# EAGLE design Via Card v2 (EAGLE 4.16)
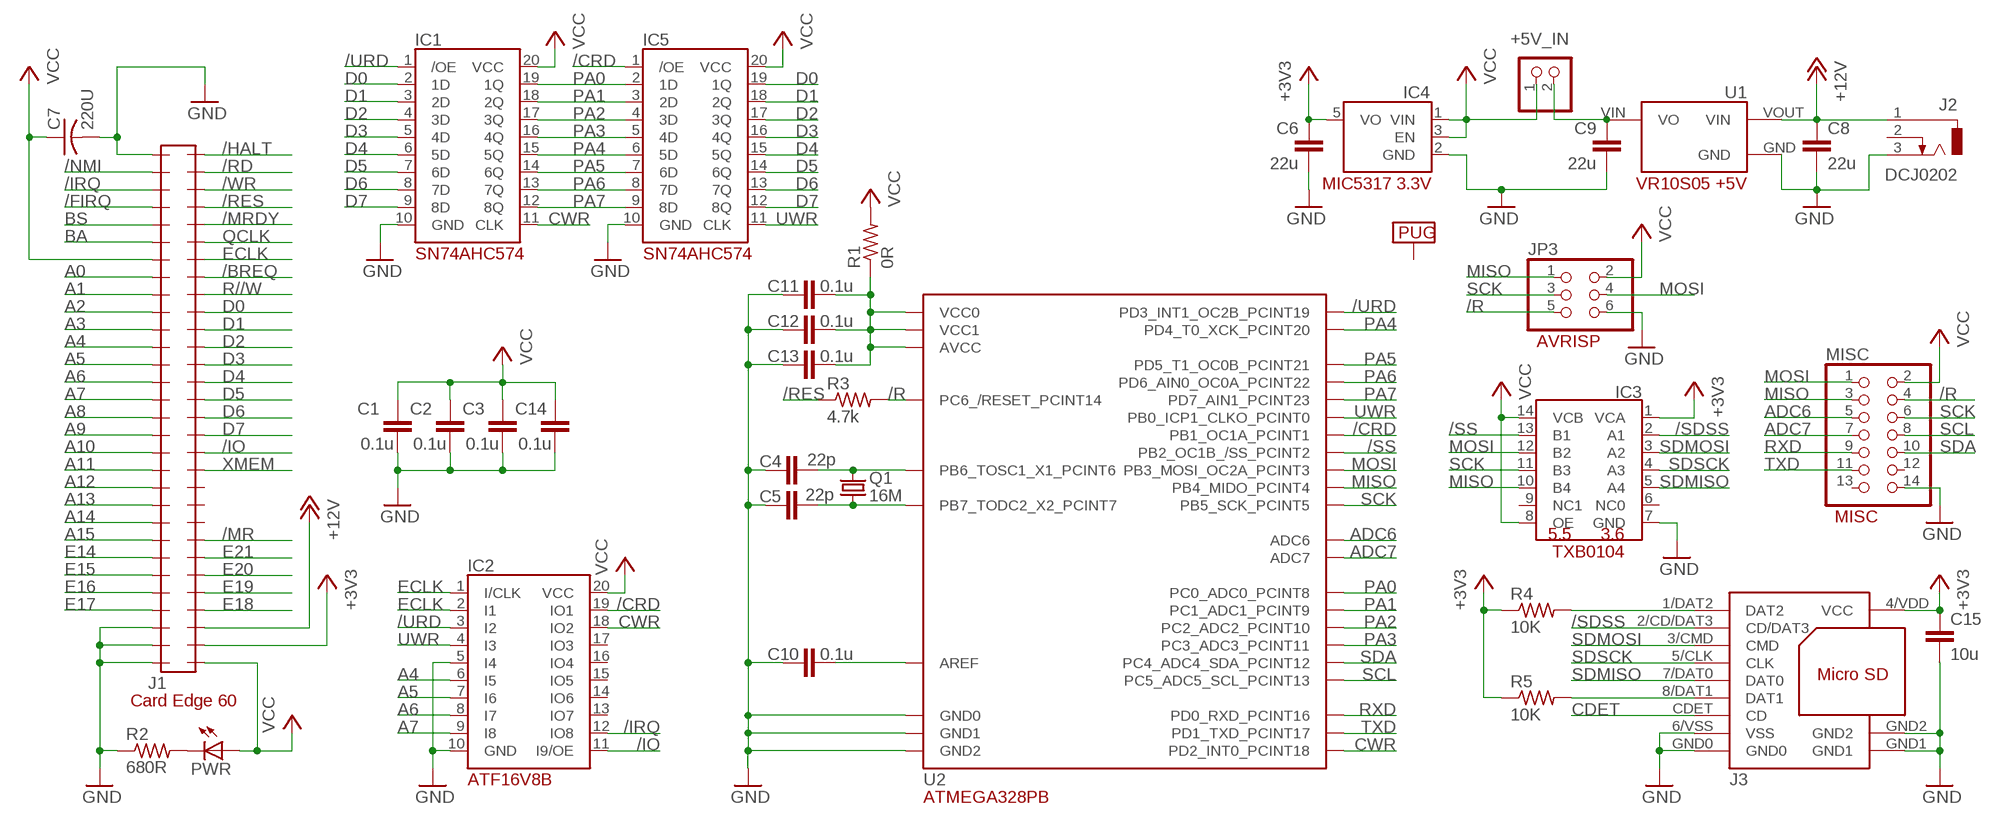
[diagram p0: schematic, sheet 1]

## Parts
+5V_IN  PINHD-1X2  [1X02]
C1  0.1u  C-EUC0603  [C0603]
C2  0.1u  C-EUC0603  [C0603]
C3  0.1u  C-EUC0603  [C0603]
C4  22p  C-EUC0603  [C0603]
C5  22p  C-EUC0603  [C0603]
C6  22u  C-EUC0805  [C0805]
C7  220U  C-US025-050X050  [C025-050X050]
C8  22u  C-EUC1206  [C1206]
C9  22u  C-EUC1206  [C1206]
C10  0.1u  C-EUC0603  [C0603]
C11  0.1u  C-EUC0603  [C0603]
C12  0.1u  C-EUC0603  [C0603]
C13  0.1u  C-EUC0603  [C0603]
C14  0.1u  C-EUC0603  [C0603]
C15  10u  C-EUC0805  [C0805]
IC1  SN74AHC574PWRSO  [SOIC20]
IC2  PLD_ATF16V8B  [DIL20]
IC3  TXB0104D  [SOIC14]
IC4  MIC5317_3.3V  [SOT23-5]
IC5  SN74AHC574PWRSO  [SOIC20]
J1  CARDEDGE_2.54_60POS  CARDEDGE_2.54_60POSEDGE  [CARDEDGE_2.54_60POS]
J2  DCJ0202  [DCJ0202]
J3  MICROSD_AMPHENOL_GTFP084328  [MICROSD_AMPHENOL_GTFP08432B1HR]
JP3  PINHD-2X3  [2X03]
MISC  PINHD-2X7  [2X07]
PWR  LED3MM  [LED3MM]
Q1  16M  CRYSTALHC49S  [HC49/S]
R1  0R  R-US_R0603  [R0603]
R2  680R  R-US_R0603  [R0603]
R3  4.7k  R-US_R0603  [R0603]
R4  10K  R-US_R0603  [R0603]
R5  10K  R-US_R0603  [R0603]
U1  VREG_5V_VR10S05  [VREG_5V_CP_POWER_VR10S05]
U2  ATMEGA238PTQFP_  [TQFP32-08]
U$1  PUG  [LARGE_PUG]

## Nets
+3V3 [supply]: C6.1 C15.1 IC3.1(VCA) IC4.5(VO) J1.32 J3.4/VDD(VCC) R4.1 R5.1
+12V [supply]: C8.1 J1.33 J2.1 U1.VOUT(VIN)
/BREQ: J1.53
/CRD: IC2.19(IO1) IC5.1(/OE) U2.13(PB1_OC1A_PCINT1)
/FIRQ: J1.4
/HALT: J1.60
/IO: IC2.11(I9/OE) J1.43
/IRQ: IC2.12(IO8) J1.3
/MR: J1.38
/MRDY: J1.56
/NMI: J1.2
/R: JP3.5 MISC.4 R3.2 U2.29(PC6_/RESET_PCINT14)
/RD: J1.59
/RES: J1.57 R3.1
/SDSS: IC3.2(A1) J3.2/CD/DAT3(CD/DAT3)
/SS: IC3.13(B1) U2.14(PB2_OC1B_/SS_PCINT2)
/URD: IC1.1(/OE) IC2.3(I2) U2.1(PD3_INT1_OC2B_PCINT19)
/WR: J1.58
A0: J1.8
A1: J1.9
A2: J1.10
A3: J1.11
A4: IC2.6(I5) J1.12
A5: IC2.7(I6) J1.13
A6: IC2.8(I7) J1.14
A7: IC2.9(I8) J1.15
A8: J1.16
A9: J1.17
A10: J1.18
A11: J1.19
A12: J1.20
A13: J1.21
A14: J1.22
A15: J1.23
ADC6: MISC.5 U2.19(ADC6)
ADC7: MISC.7 U2.22(ADC7)
BA: J1.6
BS: J1.5
CDET: J3.CDET(CD)
CWR: IC1.11(CLK) IC2.18(IO2) U2.32(PD2_INT0_PCINT18)
D0: IC1.2(1D) IC5.19(1Q) J1.51
D1: IC1.3(2D) IC5.18(2Q) J1.50
D2: IC1.4(3D) IC5.17(3Q) J1.49
D3: IC1.5(4D) IC5.16(4Q) J1.48
D4: IC1.6(5D) IC5.15(5Q) J1.47
D5: IC1.7(6D) IC5.14(6Q) J1.46
D6: IC1.8(7D) IC5.13(7Q) J1.45
D7: IC1.9(8D) IC5.12(8Q) J1.44
E14: J1.24
E15: J1.25
E16: J1.26
E17: J1.27
E18: J1.34
E19: J1.35
E20: J1.36
E21: J1.37
ECLK: IC2.1(I/CLK) IC2.2(I1) J1.54
GND [lowpwr]: C1.2 C2.2 C3.2 C4.1 C5.1 C6.2 C7.2 C8.2 C9.2 C10.1 C11.1 C12.1 C13.1 C14.2 C15.2 IC1.10(GND) IC2.5(I4) IC2.10(GND) IC3.7(GND) IC4.2(GND) IC5.10(GND) J1.1 J1.28 J1.29 J1.30 J2.3 J3.6/VSS(VSS) J3.GND0 J3.GND1 J3.GND2 JP3.6 MISC.14 R2.1 U1.GND U2.3(GND0) U2.5(GND1) U2.21(GND2)
MISO: IC3.10(B4) JP3.1 MISC.3 U2.16(PB4_MIDO_PCINT4)
MOSI: IC3.12(B2) JP3.4 MISC.1 U2.15(PB3_MOSI_OC2A_PCINT3)
N$1: J3.1/DAT2(DAT2) R4.2
N$2: PWR.K(C) R2.2
N$3 [lowpwr]: C11.2 C12.2 C13.2 R1.1 U2.4(VCC0) U2.6(VCC1) U2.18(AVCC)
N$6 [supply]: +5V_IN.2 C9.1 U1.VIN(VO)
N$7: J3.8/DAT1(DAT1) R5.2
N$15: C4.2 Q1.2 U2.7(PB6_TOSC1_X1_PCINT6)
N$16: C5.2 Q1.1 U2.8(PB7_TODC2_X2_PCINT7)
N$18 [lowpwr]: C10.2 U2.20(AREF)
PA0: IC1.19(1Q) IC5.2(1D) U2.23(PC0_ADC0_PCINT8)
PA1: IC1.18(2Q) IC5.3(2D) U2.24(PC1_ADC1_PCINT9)
PA2: IC1.17(3Q) IC5.4(3D) U2.25(PC2_ADC2_PCINT10)
PA3: IC1.16(4Q) IC5.5(4D) U2.26(PC3_ADC3_PCINT11)
PA4: IC1.15(5Q) IC5.6(5D) U2.2(PD4_T0_XCK_PCINT20)
PA5: IC1.14(6Q) IC5.7(6D) U2.9(PD5_T1_OC0B_PCINT21)
PA6: IC1.13(7Q) IC5.8(7D) U2.10(PD6_AIN0_OC0A_PCINT22)
PA7: IC1.12(8Q) IC5.9(8D) U2.11(PD7_AIN1_PCINT23)
QCLK: J1.55
R//W: J1.52
RXD: MISC.9 U2.30(PD0_RXD_PCINT16)
SCK: IC3.11(B3) JP3.3 MISC.6 U2.17(PB5_SCK_PCINT5)
SCL: MISC.8 U2.28(PC5_ADC5_SCL_PCINT13)
SDA: MISC.10 U2.27(PC4_ADC4_SDA_PCINT12)
SDMISO [lowpwr]: IC3.5(A4) J3.7/DAT0(DAT0)
SDMOSI [lowpwr]: IC3.3(A2) J3.3/CMD(CMD)
SDSCK [lowpwr]: IC3.4(A3) J3.5/CLK(CLK)
TXD: MISC.11 U2.31(PD1_TXD_PCINT17)
UWR: IC2.4(I3) IC5.11(CLK) U2.12(PB0_ICP1_CLKO_PCINT0)
VCC [supply]: +5V_IN.1 C1.1 C2.1 C3.1 C7.1 C14.1 IC1.20(VCC) IC2.20(VCC) IC3.8(OE) IC3.14(VCB) IC4.1(VIN) IC4.3(EN) IC5.20(VCC) J1.7 J1.31 JP3.2 MISC.2 PWR.A R1.2
XMEM: J1.42
Unconnected: IC2.13(IO7) IC2.14(IO6) IC2.15(IO5) IC2.16(IO4) IC2.17(IO3) IC3.6(NC0) IC3.9(NC1) J1.39 J1.40 J1.41 J2.2 MISC.12 MISC.13 U$1.P$1

## Notes on the sheet
- AVRISP
- MISC
- ATMEGA328PB

## Library data of the parts
+5V_IN = pinhead:PINHD-1X2: PIN HEADER
C1-C6 C8-C15 = rcl:C-EU: CAPACITOR, European symbol
C7 = rcl:C-US: CAPACITOR, American symbol
IC1 IC5 = 07-Retrocomputing:SN74AHC574PWR
IC2 = 07-Retrocomputing:PLD_ATF16V8B
IC3 = 07-Retrocomputing:TXB0104
IC4 = 07-Retrocomputing:MIC5317_3.3V
J1 = 07-Retrocomputing:CARDEDGE_2.54_60POS
J2 = con-jack:DCJ0202: DC POWER JACK Source: DCJ0202.pdf
J3 = 07-Retrocomputing:MICROSD_AMPHENOL_GTFP084328
JP3 = pinhead:PINHD-2X3: PIN HEADER
MISC = pinhead:PINHD-2X7: PIN HEADER
PWR = led:LED: LED OSRAM: - CHIPLED LG R971, LG N971, LY N971, LG Q971, LY Q971, LO R971, LY R971 LH N974, LH R974 LS Q976, LO Q976, LY Q976 LO Q996 - Hyper CHIPLED LW Q18S LB Q993, LB Q99A, LB R99A - SideLED LS A670, LO A670, LY A670, LG A670, LP A670 LB A673, LV A673, LT A673, LW A673 LH A674 LY A675 LS A676, LA A676, LO A676, LY A676, LW A676 LS A679, LY A679, LG A679 - Hyper Micro SIDELED® LS Y876, LA Y876, LO Y876, LY Y876 LT Y87S - SmartLED LW L88C, LW L88S LB L89C, LB L89S, LG L890 LS L89K, LO L89K, LY L89K LS L896, LA L896, LO L896, LY L896 - TOPLED LS T670, LO T670, LY T670, LG T670, LP T670 LSG T670, LSP T670, LSY T670, LOP T670, LYG T670 LG T671, LOG T671, LSG T671 LB T673, LV T673, LT T673, LW T673 LH T674 LS T676, LA T676, LO T676, LY T676, LB T676, LH T676, LSB T676, LW T676 LB T67C, LV T67C, LT T67C, LS T67K, LO T67K, LY T67K, LW E67C LS E67B, LA E67B, LO E67B, LY E67B, LB E67C, LV E67C, LT E67C LW T67C LS T679, LY T679, LG T679 LS T770, LO T770, LY T770, LG T770, LP T770 LB T773, LV T773, LT T773, LW T773 LH T774 LS E675, LA E675, LY E675, LS T675 LS T776, LA T776, LO T776, LY T776, LB T776 LHGB T686 LT T68C, LB T68C - Hyper Mini TOPLED® LB M676 - Mini TOPLED Santana® LG M470 LS M47K, LO M47K, LY M47K Source: http://www.osram.convergy.de - LUMILED® LXK2-PW12-R00, LXK2-PW12-S00, LXK2-PW14-U00, LXK2-PW14-V00 LXK2-PM12-R00, LXK2-PM12-S00, LXK2-PM14-U00 LXK2-PE12-Q00, LXK2-PE12-R00, LXK2-PE12-S00, LXK2-PE14-T00, LXK2-PE14-U00 LXK2-PB12-K00, LXK2-PB12-L00, LXK2-PB12-M00, LXK2-PB14-N00, LXK2-PB14-P00, LXK2-PB14-Q00 LXK2-PR12-L00, LXK2-PR12-M00, LXK2-PR14-Q00, LXK2-PR14-R00 LXK2-PD12-Q00, LXK2-PD12-R00, LXK2-PD12-S00 LXK2-PH12-R00, LXK2-PH12-S00 LXK2-PL12-P00, LXK2-PL12-Q00, LXK2-PL12-R00 Source: www.luxeon.com
Q1 = crystal:CRYSTAL: CRYSTAL
R1-R5 = rcl:R-US_: RESISTOR, American symbol
U1 = 07-Retrocomputing:VREG_5V_VR10S05
U2 = 02_atmel:ATMEGA238P
U$1 = 07-Retrocomputing:PUG

## Net classes
0 default: width 0.203 mm, drill 0.203 mm, clearance 0.254 mm
1 supply: width 0.61 mm, drill 0.203 mm, clearance 0.305 mm
2 lowpwr: width 0.254 mm, drill 0.203 mm, clearance 0.254 mm

## Board
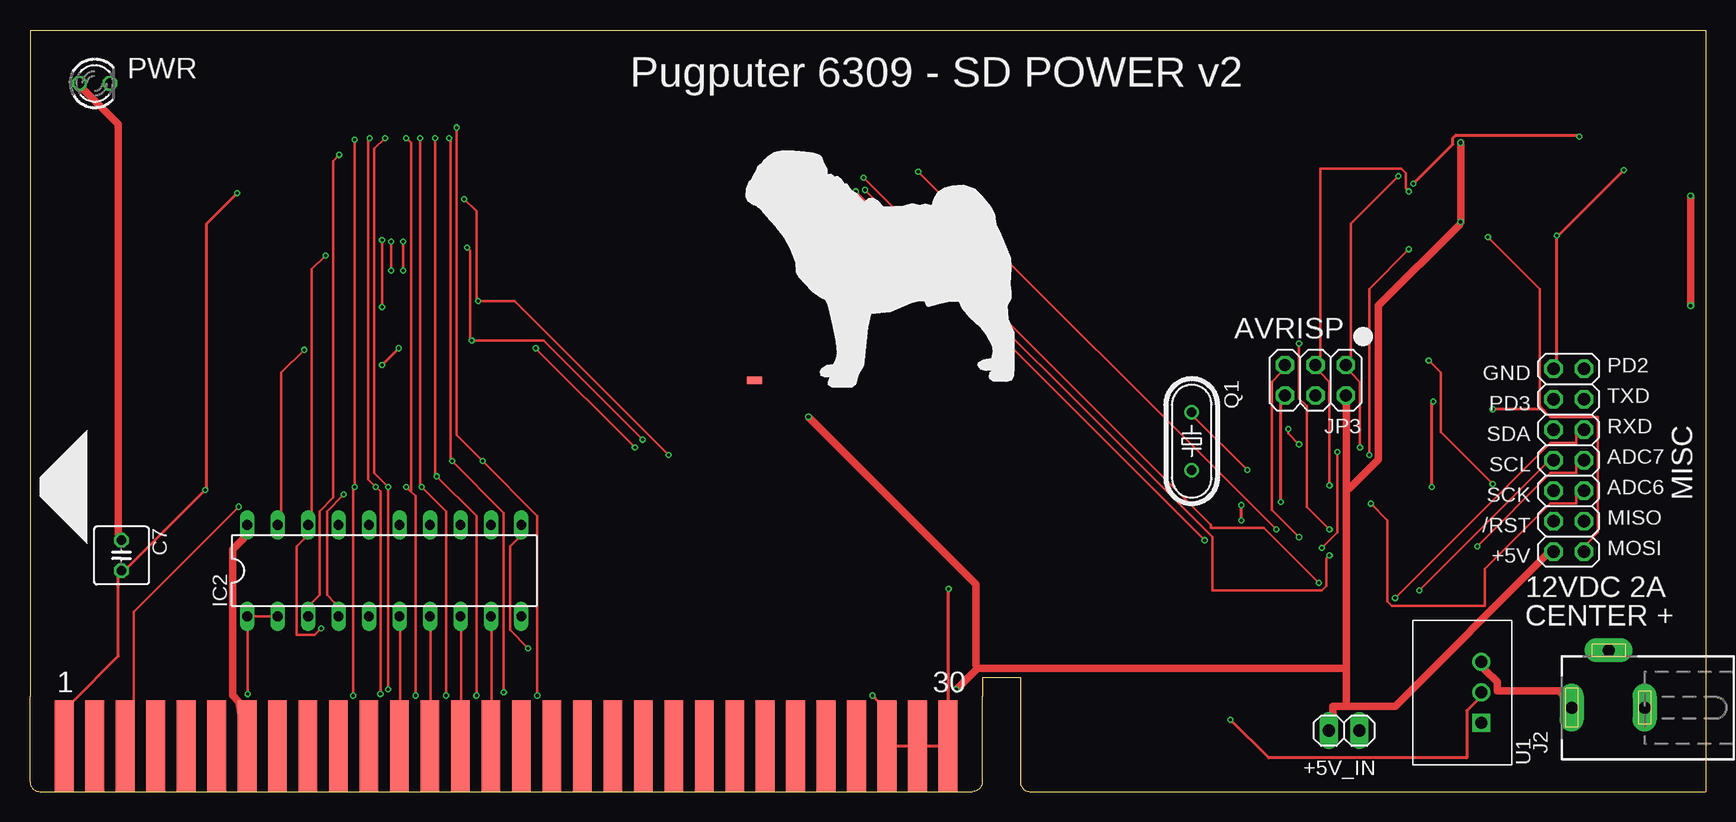
[diagram p1: board, top side]
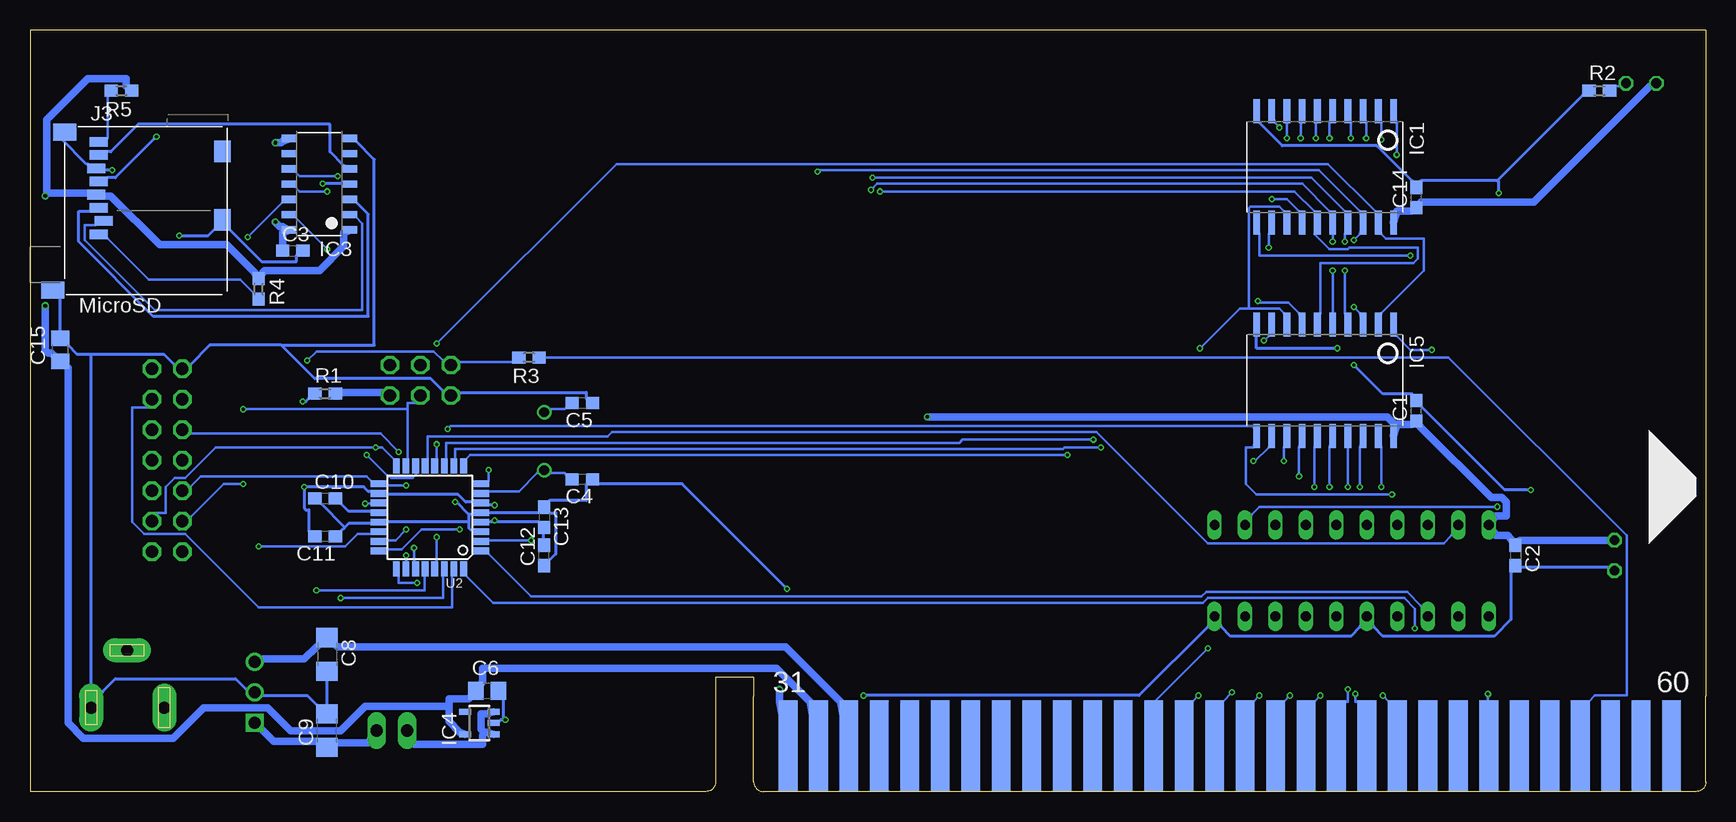
[diagram p2: board, bottom side, seen from below]

Size 139.7 x 63.5 mm. Coordinates in mm from the lower left corner, seen from the top.
Outline: 0,7.94 0,63.5 139.7,63.5 139.7,0 83.34,0 arc-90 82.55,0.79 82.55,9.53 79.38,9.53 79.38,7.94
Copper layers (1*16): Top 0.0356mm / dielectric 1.6mm / Bottom 0.0356mm
Design rules "oshpark-2layer": minimum track width 6mil, minimum drill 10mil, track to track 6mil, track to pad 6mil, pad to pad 6mil, via to via 6mil, smd to smd 6mil, copper to edge 15mil, drill to drill 6mil, minimum pad ring 5mil, minimum via ring 5mil, stop-mask expansion 2.5mil, vias tented up to drill 0mil, thermal gap 10mil
vRestrict: area 122.2,21.4 to 139.7,38.1

### Footprints (pad centres in the part's own frame; a part is rotated, then mirrored left to right if it is on the bottom)
1X02 = drill 1.016 long: 1 -1.27,0; 2 1.27,0
C0603 = smd 1.1 x 1: 1 -0.85,0; 2 0.85,0
C0805 = smd 1.3 x 1.5: 1 -0.95,0; 2 0.95,0
C025-050X050 = drill 0.813 octagon: 1 -1.27,0; 2 1.27,0
C1206 = smd 1.6 x 1.8: 1 -1.4,0; 2 1.4,0
SOIC20 = smd 2 x 0.55: 1 -4.645,5.715; 2 -4.645,4.445; 3 -4.645,3.175; 4 -4.645,1.905; 5 -4.645,0.635; 6 -4.645,-0.635; 7 -4.645,-1.905; 8 -4.645,-3.175; 9 -4.645,-4.445; 10 -4.645,-5.715; 11 4.645,-5.715; 12 4.645,-4.445; 13 4.645,-3.175; 14 4.645,-1.905; 15 4.645,-0.635; 16 4.645,0.635; 17 4.645,1.905; 18 4.645,3.175; 19 4.645,4.445; 20 4.645,5.715
DIL20 = drill 0.813 long: 1 -11.43,-3.81; 2 -8.89,-3.81; 3 -6.35,-3.81; 4 -3.81,-3.81; 5 -1.27,-3.81; 6 1.27,-3.81; 7 3.81,-3.81; 8 6.35,-3.81; 9 8.89,-3.81; 10 11.43,-3.81; 11 11.43,3.81; 12 8.89,3.81; 13 6.35,3.81; 14 3.81,3.81; 15 1.27,3.81; 16 -1.27,3.81; 17 -3.81,3.81; 18 -6.35,3.81; 19 -8.89,3.81; 20 -11.43,3.81
SOIC14 = smd 1.2 x 0.6: 1 -2.54,3.81; 2 -2.54,2.54; 3 -2.54,1.27; 4 -2.54,0; 5 -2.54,-1.27; 6 -2.54,-2.54; 7 -2.54,-3.81; 8 2.54,-3.81; 9 2.54,-2.54; 10 2.54,-1.27; 11 2.54,0; 12 2.54,1.27; 13 2.54,2.54; 14 2.54,3.81
SOT23-5 = smd 0.5 x 1: 1 -0.95,-1.2; 2 0,-1.2; 3 0.95,-1.2; 4 0.95,1.2; 5 -0.95,1.2
CARDEDGE_2.54_60POS = smd 1.556 x 7.62: 1 -36.83,3.81; 2 -34.29,3.81; 3 -31.75,3.81; 4 -29.21,3.81; 5 -26.67,3.81; 6 -24.13,3.81; 7 -21.59,3.81; 8 -19.05,3.81; 9 -16.51,3.81; 10 -13.97,3.81; 11 -11.43,3.81; 12 -8.89,3.81; 13 -6.35,3.81; 14 -3.81,3.81; 15 -1.27,3.81; 16 1.27,3.81; 17 3.81,3.81; 18 6.35,3.81; 19 8.89,3.81; 20 11.43,3.81; 21 13.97,3.81; 22 16.51,3.81; 23 19.05,3.81; 24 21.59,3.81; 25 24.13,3.81; 26 26.67,3.81; 27 29.21,3.81; 28 31.75,3.81; 29 34.29,3.81; 30 36.83,3.81 | smd 1.556 x 7.62 bottom: 31 36.83,3.81; 32 34.29,3.81; 33 31.75,3.81; 34 29.21,3.81; 35 26.67,3.81; 36 24.13,3.81; 37 21.59,3.81; 38 19.05,3.81; 39 16.51,3.81; 40 13.97,3.81; 41 11.43,3.81; 42 8.89,3.81; 43 6.35,3.81; 44 3.81,3.81; 45 1.27,3.81; 46 -1.27,3.81; 47 -3.81,3.81; 48 -6.35,3.81; 49 -8.89,3.81; 50 -11.43,3.81; 51 -13.97,3.81; 52 -16.51,3.81; 53 -19.05,3.81; 54 -21.59,3.81; 55 -24.13,3.81; 56 -26.67,3.81; 57 -29.21,3.81; 58 -31.75,3.81; 59 -34.29,3.81; 60 -36.83,3.81
DCJ0202 = drill 1 pad 2 long: 1 0,3.1; 2 4.8,0; 3 0,-3
MICROSD_AMPHENOL_GTFP08432B1HR = smd 0.8 x 1.5: 1/DAT2 1.95,-10.3; 2/CD/DAT3 0.85,-9.9; 3/CMD -0.25,-10.3; 4/VDD -1.35,-10.5; 5/CLK -2.45,-10.3; 6/VSS -3.55,-10.5; 7/DAT0 -4.65,-10.3; 8/DAT1 -5.75,-10.3 | smd 1.8 x 1.4: CDET -4.95,0; GND0 0.75,0 | smd 1.4 x 1.9: GND1 -6.55,-13.15; GND2 6.6,-14.15
2X03 = drill 1.016 octagon: 1 -2.54,-1.27; 2 -2.54,1.27; 3 0,-1.27; 4 0,1.27; 5 2.54,-1.27; 6 2.54,1.27
2X07 = drill 1.016 octagon: 1 -7.62,-1.27; 2 -7.62,1.27; 3 -5.08,-1.27; 4 -5.08,1.27; 5 -2.54,-1.27; 6 -2.54,1.27; 7 0,-1.27; 8 0,1.27; 9 2.54,-1.27; 10 2.54,1.27; 11 5.08,-1.27; 12 5.08,1.27; 13 7.62,-1.27; 14 7.62,1.27
LED3MM = drill 0.813 octagon: A -1.27,0; K 1.27,0
HC49/S = drill 0.813 round: 1 -2.413,0; 2 2.413,0
R0603 = smd 1.1 x 1: 1 -0.85,0; 2 0.85,0
VREG_5V_CP_POWER_VR10S05 = drill 1 round: GND 0,0; VOUT 2.54,0 | drill 1 square: VIN -2.54,0
TQFP32-08 = smd 1.27 x 0.559: 1 -4.293,2.8; 2 -4.293,2; 3 -4.293,1.2; 4 -4.293,0.4; 5 -4.293,-0.4; 6 -4.293,-1.2; 7 -4.293,-2; 8 -4.293,-2.8; 17 4.293,-2.8; 18 4.293,-2; 19 4.293,-1.2; 20 4.293,-0.4; 21 4.293,0.4; 22 4.293,1.2; 23 4.293,2; 24 4.293,2.8 | smd 0.559 x 1.27: 9 -2.8,-4.293; 10 -2,-4.293; 11 -1.2,-4.293; 12 -0.4,-4.293; 13 0.4,-4.293; 14 1.2,-4.293; 15 2,-4.293; 16 2.8,-4.293; 25 2.8,4.293; 26 2,4.293; 27 1.2,4.293; 28 0.4,4.293; 29 -0.4,4.293; 30 -1.2,4.293; 31 -2,4.293; 32 -2.8,4.293
LARGE_PUG = smd 1.27 x 0.635: P$1 2.286,3.962

### Placement (x,y rotation side)
+5V_IN  109.54,5.08 0 top
C1  24.13,31.75 90 bottom
C2  15.88,19.68 270 bottom
C3  117.79,45.09 0 bottom
C4  93.66,26.04 180 bottom
C5  93.66,32.38 180 bottom
C6  101.6,8.41 0 bottom
C7  7.62,19.68 270 top
C8  114.94,11.43 270 bottom
C9  114.94,5.08 90 bottom
C10  115.09,24.45 0 bottom
C11  115.09,21.27 180 bottom
C12  96.84,19.68 90 bottom
C13  96.84,22.86 270 bottom
C14  24.13,49.53 90 bottom
C15  137.16,36.83 90 bottom
IC1  31.75,52.07 270 bottom
IC2  29.53,18.41 0 top
IC3  115.57,50.64 180 bottom
IC4  102.23,5.71 90 bottom
IC5  31.75,34.29 270 bottom
J1  39.69,0 0 top
J2  131.6,6.99 90 top
J3  123.67,48.42 270 bottom
JP3  107.16,34.29 180 top
MISC  128.27,27.62 90 top
PWR  5.4,59.05 0 top
Q1  96.84,29.21 270 top
R1  115.09,33.18 0 bottom
R2  8.89,58.42 0 bottom
R3  98.11,36.2 180 bottom
R4  120.65,41.91 270 bottom
R5  132.08,58.42 180 bottom
U1  120.97,8.26 90 top
U2  106.36,22.86 180 bottom
U$1  58.1,30.32 0 top

### Tracks (layer width: path | path; a pad name or v marks a point on that pad's centre or on a via)
+3V3  (via drill 0.3)
  Top 0.61: v138.43,40.51 v138.43,49.66
  Bottom 0.61: 104.78,7.11 104.78,7.75 103.12,7.75 C6.1 101.98,9.14 101.98,10.29 77.47,10.29 74.68,7.49 J1.32 | 104.78,7.11 104.78,5.84 103.89,4.95 IC4.5 | IC3.1 113.54,46.61 113.54,45.47 115.57,43.43 120.14,43.43 120.27,43.31 R4.1 121.03,43.31 123.32,45.59 128.91,45.59 132.97,49.66 133.48,49.66 J3.4/VDD 134.87,49.91 138.3,49.91 | 138.3,49.91 138.3,56.01 134.87,59.44 131.7,59.44 131.7,58.8 R5.1 | v138.43,40.51 138.43,36.83 138.18,36.58 137.92,36.58 137.79,36.45 C15.1 136.53,35.31 136.53,5.71 135.25,4.45 127.76,4.45 125.22,6.99 119.89,6.99 117.98,5.08 113.79,5.08 111.76,7.11 104.78,7.11 | v138.43,49.66 138.3,49.91
+12V
  Top 0.61: J2.1 127.51,8.38 122.3,8.38 122.3,9.14 121.28,10.16 U1.VOUT
  Bottom 0.61: U1.VOUT 120.27,11.05 116.84,11.05 115.82,12.06 C8.1 114.05,12.06 76.71,12.06 72.14,7.49 J1.33
/CRD  (via drill 0.25)
  Top 0.203: v22.86,36.83 20.95,34.92 20.95,23.37 IC2.19
  Bottom 0.203: U2.13 106.55,27.69 106.55,29.59 91.57,29.59 91.19,29.97 50.8,29.97 41.53,20.7 21.84,20.7 21.21,21.34 IC2.19 | v22.86,36.83 24.64,36.83 25.78,37.97 IC5.1
/IO  (via drill 0.25)
  Top 0.203: v41.53,11.94 40.01,13.46 40.01,20.45 40.64,21.08 IC2.11
  Bottom 0.203: v41.53,11.94 45.97,7.49 J1.43
/IRQ  (via drill 0.25)
  Top 0.203: v17.4,23.75 8.64,14.99 8.64,7.49 J1.3
  Bottom 0.203: v17.4,23.75 37.21,23.75 37.85,23.11 IC2.12
/R  (via drill 0.25)
  Top 0.203: v105.79,21.21 103.5,23.5 103.5,34.16 104.27,34.92 JP3.5 | v121.92,25.65 117.6,29.97 117.6,34.92 v116.59,35.94
  Bottom 0.203: R3.2 99.44,35.81 103.89,35.81 JP3.5 105.28,35.94 106.05,36.7 115.82,36.7 v116.59,35.94 | v105.79,21.21 105.79,19.18 U2.29 | v121.92,25.65 123.57,25.65 126.36,22.86 MISC.4
/RES
  Bottom 0.203: R3.1 21.46,36.2 6.6,21.34 6.6,8 9.27,8 9.78,7.49 J1.57
/SDSS
  Bottom 0.203: IC3.2 112.52,47.88 112.01,47.37 112.01,40.13 129.29,40.13 135.13,45.97 135.13,47.24 134.24,47.24 J3.2/CD/DAT3
/SS  (via drill 0.25)
  Top 0.203: v114.94,45.21 111.63,41.91 v111.63,28.07
  Bottom 0.203: v114.94,45.21 117.6,47.88 IC3.13 | v111.63,28.07 109.86,26.29 109.73,26.29 109.6,26.16 107.82,26.16 107.44,26.54 U2.14
/URD  (via drill 0.25)
  Top 0.203: v25.78,53.09 25.27,52.58 25.27,24.51 24.13,23.37 24.13,16.38 23.5,15.75 IC2.3
  Bottom 0.203: U2.1 101.47,19.81 97.92,16.26 42.04,16.26 41.66,16.64 24.89,16.64 23.75,15.49 IC2.3 | v25.78,53.09 25.78,55.75 IC1.1
A4
  Top 0.203: IC2.6 30.86,13.46 30.86,7.49 J1.12
A5
  Top 0.203: IC2.7 33.4,13.46 33.4,7.49 J1.13
A6
  Top 0.203: IC2.8 35.94,13.46 35.94,7.49 J1.14
A7
  Top 0.203: IC2.9 38.48,13.46 38.48,7.49 J1.15
ADC6  (via drill 0.25)
  Top 0.203: v111.76,24 113.16,22.61 113.16,15.88 113.54,15.49 121.28,15.49 121.28,18.54 126.75,24 128.91,24 128.91,24.77 MISC.5
  Bottom 0.203: v111.76,24 111.25,24 U2.19
ADC7  (via drill 0.25)
  Top 0.203: v120.65,20.45 126.75,26.54 128.91,26.54 128.91,27.3 MISC.7
  Bottom 0.203: v120.65,20.45 113.41,20.45 112.39,21.46 111.25,21.46 U2.22
CWR  (via drill 0.25)
  Top 0.203: v24.26,13.59 23.75,13.08 22.23,13.08 22.23,20.45 22.86,21.08 IC2.18 23.5,23.37 23.5,43.56 v24.64,44.7
  Bottom 0.203: v24.26,13.59 24.26,15.24 25.15,16.13 41.53,16.13 41.91,15.75 101.09,15.75 103.38,18.03 U2.32 | v24.64,44.7 37.21,44.7 37.21,46.48 IC1.11
D0  (via drill 0.25)
  Top 0.203: v26.92,8 26.92,25.27 v27.05,25.4 v27.05,54.36
  Bottom 0.203: v27.05,25.4 27.05,28.7 IC5.19 | v26.92,8 26.42,7.49 J1.51 | v27.05,54.36 27.05,55.75 IC1.2
D1  (via drill 0.25)
  Top 0.203: v29.21,8.13 29.21,25.02 v28.83,25.4 28.19,26.04 28.19,54.36 v28.32,54.48
  Bottom 0.203: v28.83,25.4 28.83,28.7 IC5.18 | v29.21,8.13 29.21,7.49 28.96,7.49 J1.50 | v28.32,54.48 28.32,55.75 IC1.3
D2  (via drill 0.25)
  Top 0.203: v29.84,8.51 v29.84,25.4 28.7,26.54 28.7,53.59 v29.59,54.48
  Bottom 0.203: v29.84,8.51 29.84,7.49 30.1,7.49 J1.49 | v29.84,25.4 IC5.17 | v29.59,54.48 29.59,55.75 IC1.4
D3  (via drill 0.25)
  Top 0.203: 31.69,25.08 32.13,24.64 v32.13,8 | 31.69,25.08 v31.37,25.4 | v31.37,54.48 31.75,54.1 31.75,25.15 31.69,25.08
  Bottom 0.203: v31.37,25.4 31.37,28.7 IC5.16 | v32.13,8 32.64,7.49 J1.48 | v31.37,54.48 31.37,55.75 IC1.5
D4  (via drill 0.25)
  Top 0.203: v34.67,8 34.67,23.37 v32.64,25.4 32.51,25.53 v32.51,54.48
  Bottom 0.203: v32.64,25.4 32.64,28.7 IC5.15 | v34.67,8 35.18,7.49 J1.47 | v32.51,54.48 32.51,55.75 IC1.6
D5  (via drill 0.25)
  Top 0.203: v37.21,8 37.21,22.99 v33.91,26.29 33.78,26.42 v33.78,54.48
  Bottom 0.203: v33.91,26.29 33.91,28.7 IC5.14 | v37.21,8 37.72,7.49 J1.46 | v33.78,54.48 33.78,55.75 IC1.7
D6  (via drill 0.25)
  Top 0.203: v39.5,8.26 39.5,23.24 v35.18,27.56 35.05,27.69 35.05,54.36 v34.92,54.48
  Bottom 0.203: v35.18,27.56 35.18,28.7 IC5.13 | v39.5,8.26 40.26,7.49 J1.45 | v34.92,54.48 IC1.8
D7  (via drill 0.25)
  Top 0.203: v42.29,8 42.29,22.99 v37.72,27.56 35.56,29.72 v35.56,55.37
  Bottom 0.203: v37.72,27.56 37.59,27.56 36.45,28.7 IC5.12 | v42.29,8 42.8,7.49 J1.44 | v35.56,55.37 35.94,55.75 IC1.9
ECLK  (via drill 0.25)
  Top 0.203: IC2.2 IC2.1 18.16,13.46 v18.16,8.13
  Bottom 0.203: v18.16,8.13 18.16,7.49 J1.54
GND  (via drill 0.25)
  Top 0.254: v29.34,35.56 v30.73,36.96 | J1.1 3.56,7.49 7.37,11.3 7.37,17.91 C7.2 8.13,18.67 v14.61,25.15 14.73,25.27 14.73,47.37 v17.27,49.91 | v76.58,16.89 76.58,7.49 J1.30 J1.29 J1.28 70.74,7.49 v70.23,8 | v100.08,5.97 103.25,2.79 119.76,2.79 119.76,6.73 120.65,7.62 U1.GND | 127.32,46.29 127.25,46.23 127.25,35.94 MISC.14 | 127.32,46.29 v132.84,51.82 | 127.32,46.29 v127.25,46.35 | v104.27,24.13 104.27,32.38 JP3.6
  Bottom 0.254: IC1.10 37.21,55.75 35.31,53.85 27.43,53.85 24.51,50.93 C14.2 23.75,50.93 17.4,50.93 17.34,50.99 | 17.34,50.99 10.29,58.04 R2.1 | C7.2 8.13,18.67 15.49,18.67 C2.2 16.26,18.29 16.26,14.35 17.65,12.95 26.92,12.95 27.69,13.72 IC2.5 28.83,13.72 29.59,12.95 39.62,12.95 40.39,13.72 IC2.10 41.53,13.72 47.24,8 v70.23,8 | v14.61,25.15 16.76,25.15 23.75,32.13 C1.2 24.51,33.15 26.92,33.15 v29.34,35.56 | v30.73,36.96 37.47,36.96 IC5.10 | v17.27,49.91 17.27,50.93 17.34,50.99 | 113.47,22.04 113.16,22.35 111.25,22.35 U2.21 110.11,22.48 103.12,22.48 | 113.47,22.04 113.79,21.72 C11.1 | C10.1 115.44,24 113.47,22.04 | 103.12,23.11 103.12,22.48 | 103.12,22.48 103.12,21.97 103,21.84 102.62,21.84 U2.3 | 103.12,23.11 102.62,23.11 U2.5 101.47,23.24 97.28,23.24 C13.1 | C13.1 96.39,24.26 93.34,24.26 93.34,25.65 C4.1 92.33,25.65 85.34,25.65 v76.58,16.89 | C12.1 96.39,19.3 95.89,19.81 95.89,23.24 96.39,23.24 C13.1 | C8.2 C9.2 115.82,7.24 116.59,8 120.27,8 U1.GND 121.67,8.51 122.56,9.4 132.59,9.4 133.6,8.38 J2.3 134.62,8.89 134.62,36.45 | 100.27,6.03 100.2,6.1 100.2,7.75 C6.2 | 100.27,6.03 100.33,5.97 100.46,5.97 100.58,5.84 IC4.2 | v100.08,5.97 100.2,5.97 100.27,6.03 | C5.1 93.34,32.77 93.34,33.27 103.89,33.27 JP3.6 105.28,33.4 106.3,34.42 115.95,34.42 118.75,37.21 | C3.2 117.47,44.7 117.47,44.2 120.4,44.2 123.06,46.86 J3.GND0 124.33,46.86 124.84,46.35 v127.25,46.35 | J3.GND1 137.03,54.36 135,52.32 134.87,52.32 J3.6/VSS 133.48,51.82 v132.84,51.82 | J3.GND2 137.16,41.15 C15.2 136.53,37.21 135.76,36.45 134.62,36.45 | 118.75,37.21 124.71,37.21 126.36,35.56 MISC.14 127.64,35.56 128.52,36.45 134.62,36.45
  Bottom 0.254: 118.75,37.21 111,37.21 111,52.7 112.52,54.23 IC3.7 | 103.12,23.11 104.14,24.13 v104.27,24.13
MISO  (via drill 0.25)
  Top 0.203: v114.05,51.31 110.11,47.37 110.11,36.2 JP3.1 110.11,34.92 110.87,34.16 v110.87,28.7
  Bottom 0.203: v114.05,51.31 117.22,51.31 117.6,51.69 IC3.10 | U2.16 109.35,27.69 110.36,28.7 v110.87,28.7 124.21,28.7 126.75,26.16 127.64,26.16 128.4,25.4 128.4,23.24 129.29,23.24 MISC.3
MOSI  (via drill 0.25)
  Top 0.203: v121.54,46.23 125.86,41.91 125.86,32.13 125.92,32.07 | 125.92,32.07 126.75,31.24 130.68,31.24 130.68,21.59 129.79,20.7 MISC.1 | v121.92,31.88 125.86,31.88 125.86,32 125.92,32.07
  Bottom 0.203: 108.2,31.88 108.2,32.38 107.57,32.38 JP3.4 | 108.2,31.88 108.2,27.69 U2.15 | v121.54,46.23 118.62,49.15 IC3.12 | 108.2,31.88 v121.92,31.88
N$1
  Bottom 0.203: R4.2 121.03,41.53 122.17,42.67 129.79,42.67 133.22,46.1 J3.1/DAT2
N$2
  Bottom 0.203: R2.2 7.49,58.8 7.24,58.8 PWR.K
N$3  (via drill 0.25)
  Top 0.254: v116.97,32.51 116.84,32.38 v116.84,25.4 | v100.97,22.61 v100.97,23.88
  Bottom 0.254: C12.2 96.9,21.08 96.9,21.46 C13.2 97.28,22.48 100.97,22.48 | 100.97,22.48 101.47,22.48 U2.4 | C11.2 116.46,21.72 116.46,23.5 116.71,23.5 116.84,23.62 v116.84,25.4 111.89,25.4 111.51,25.02 111.25,25.02 U2.18 110.11,24.77 104.01,24.77 103.38,24.13 102.62,24.13 U2.6 101.47,23.88 v100.97,23.88 | v116.97,32.51 116.71,32.51 116.46,32.77 R1.1 | 100.97,22.48 v100.97,22.61
N$6
  Bottom 0.61: +5V_IN.2 111.51,4.06 114.05,4.06 C9.1 115.82,4.19 119.38,4.19 120.27,5.08 U1.VIN
N$7
  Bottom 0.203: R5.2 133.22,58.04 133.22,54.48 J3.8/DAT1
N$15
  Bottom 0.203: C4.2 95,26.42 95.12,26.54 96.27,26.54 Q1.2 97.41,26.54 98.93,25.02 101.47,25.02 U2.7
N$16  (via drill 0.25)
  Top 0.203: v101.47,26.8 97.16,31.11 Q1.1
  Bottom 0.203: C5.2 95,32 95.12,31.88 96.27,31.88 Q1.1 | v101.47,26.8 101.47,25.91 U2.8
N$18
  Bottom 0.254: C10.2 113.79,24 113.16,23.37 111.25,23.37 U2.20
PA0  (via drill 0.25)
  Top 0.203: v108.33,21.84 106.43,23.75 106.43,32.13 105.79,32.77 v105.79,37.34
  Bottom 0.203: v108.33,21.84 109.22,20.95 110.11,20.95 U2.23 | v105.79,37.34 90.81,52.32 31.5,52.32 27.56,48.39 IC1.19 27.05,46.48 26.67,46.1 23.5,46.1 23.5,43.43 27.05,39.88 IC5.2
PA1  (via drill 0.25)
  Top 0.203: v74.04,51.69 v103.89,21.84 | v29.34,40.39 v29.34,45.97
  Bottom 0.203: v103.89,21.84 107.06,21.84 108.71,20.19 110.11,20.19 U2.24 | v74.04,51.69 73.91,51.82 32.26,51.82 28.83,48.39 IC1.18 28.83,46.48 v29.34,45.97 | v29.34,40.39 28.83,39.88 IC5.3
PA2  (via drill 0.25)
  Top 0.203: v107.44,17.4 102.87,21.97 98.42,21.97 98.42,22.23 v69.47,51.18 | v30.1,43.43 v30.1,45.85
  Bottom 0.203: v107.44,17.4 108.97,17.4 108.97,18.03 U2.25 | v69.47,51.18 32.89,51.18 30.1,48.39 IC1.17 30.1,46.48 v30.1,45.85 | v30.1,43.43 30.1,39.88 IC5.4
PA3  (via drill 0.25)
  Top 0.203: v108.33,19.68 108.08,19.43 108.08,17.14 107.7,16.76 98.55,16.76 98.55,21.21 v69.6,50.16 | v31.11,43.43 v31.11,45.85
  Bottom 0.203: v108.33,19.68 108.33,19.18 U2.26 | v69.6,50.16 69.09,50.67 33.66,50.67 31.37,48.39 IC1.16 v31.11,45.85 | IC5.5 v31.11,43.43
PA4  (via drill 0.25)
  Top 0.203: v68.83,50.04 v97.92,20.95
  Bottom 0.203: v97.92,20.95 101.47,20.95 U2.2 | v68.83,50.04 34.29,50.04 32.64,48.39 IC1.15 32.64,46.48 31.37,45.21 29.84,45.21 29.72,45.34 24,45.34 24,44.45 24.38,44.07 32.13,44.07 32.13,39.88 IC5.6
PA5  (via drill 0.25)
  Top 0.203: v53.21,28.07 40.39,40.89 v37.34,40.89 37.21,41.02 37.21,48.39 v36.2,49.4
  Bottom 0.203: v53.21,28.07 103,28.07 103.38,27.69 U2.9 | v37.34,40.89 37.21,40.77 34.8,40.77 33.91,39.88 IC5.7 | v36.2,49.4 34.92,49.4 33.91,48.39 IC1.14
PA6  (via drill 0.25)
  Top 0.203: v42.16,36.96 v50.42,28.7
  Bottom 0.203: v50.42,28.7 53.47,28.7 53.59,28.57 104.27,28.57 104.27,27.69 U2.10 | v42.16,36.96 38.86,40.26 38.1,40.26 | 38.1,40.26 35.56,40.26 35.18,39.88 IC5.8 | 38.1,40.26 38.1,48.64 37.97,48.77 35.56,48.77 35.18,48.39 IC1.13
PA7  (via drill 0.25)
  Top 0.203: v51.05,29.34 42.8,37.59 v36.83,37.59 36.7,37.72 36.7,45.09 v36.45,45.34
  Bottom 0.203: v51.05,29.34 61.98,29.34 62.23,29.08 105.03,29.08 105.03,27.69 U2.11 | v36.83,37.59 36.45,37.97 IC5.9 | v36.45,45.34 36.45,46.48 IC1.12
RXD  (via drill 0.25)
  Top 0.203: v113.79,16.13 126.75,29.08 128.91,29.08 128.91,29.84 MISC.9
  Bottom 0.203: v113.79,16.13 105.28,16.13 105.28,18.03 U2.30
SCK  (via drill 0.25)
  Top 0.203: v114.94,50.04 114.68,50.29 114.68,51.56 114.3,51.94 107.57,51.94 107.57,36.2 JP3.3 107.57,34.92 108.33,34.16 v108.33,25.53
  Bottom 0.203: MISC.6 126.36,25.4 125.48,26.29 111.63,26.29 111.25,25.91 U2.17 110.11,25.53 v108.33,25.53 | v114.94,50.04 117.22,50.04 117.6,50.42 IC3.11
SCL  (via drill 0.25)
  Top 0.203: v115.82,16.76 126.36,27.3 MISC.8
  Bottom 0.203: v115.82,16.76 106.81,16.76 106.81,18.03 U2.28
SDA  (via drill 0.25)
  Top 0.203: v107.7,20.32 108.97,21.59 v108.97,28.32
  Bottom 0.203: v107.7,20.32 107.7,19.18 U2.27 | v108.97,28.32 110.49,29.84 126.36,29.84 MISC.10
SDMISO
  Bottom 0.254: IC3.5 113.54,52.2 114.68,53.34 114.68,55.63 130.68,55.63 132.97,53.34 133.22,53.34 J3.7/DAT0
SDMOSI
  Bottom 0.254: IC3.3 112.52,49.15 111.51,48.13 111.51,39.62 129.41,39.62 135.64,45.85 135.64,48.39 134.62,48.39 J3.3/CMD
SDSCK  (via drill 0.25)
  Top 0.254: v115.32,50.67 118.62,53.98 118.62,54.48 118.87,54.74 129.16,54.74 v129.16,54.61
  Bottom 0.254: v115.32,50.67 113.54,50.67 IC3.4 | v129.16,54.61 132.59,51.18 133.22,51.18 J3.5/CLK
TXD
  Bottom 0.203: U2.31 104.52,18.03 104.52,15.37 120.65,15.37 126.75,21.46 130.18,21.46 131.19,22.48 131.19,32 129.79,32 MISC.11
UWR  (via drill 0.25)
  Top 0.203: v105.79,28.96 104.9,29.84 v104.9,30.23 | v26.16,24.77 24.77,23.37 24.77,16.38 25.4,15.75 IC2.4
  Bottom 0.203: v105.79,28.96 105.79,27.69 U2.12 | v104.9,30.23 104.65,30.48 37.72,30.48 IC5.11 37.72,28.7 38.35,28.7 38.35,25.65 37.47,24.77 v26.16,24.77
VCC  (via drill 0.3)
  Top 0.61: J1.7 17.4,7.49 16.89,8 16.89,20.19 17.78,21.08 IC2.20 | PWR.A 4.45,58.55 7.37,55.63 7.37,21.46 C7.1 | v119.25,54.1 v119.25,47.5 119.13,47.24 112.39,40.51 112.39,27.69 109.98,25.27 109.73,25.27 | 109.73,7.11 108.58,7.11 108.58,6.48 +5V_IN.1 | 109.73,7.11 113.79,7.11 126.36,19.68 MISC.2 | 109.73,10.29 109.73,25.27 | 109.73,25.27 109.73,32.38 JP3.2 | 109.73,10.29 109.73,7.11 | 78.99,10.29 v77.22,8.51 | 78.99,10.29 109.73,10.29 | v64.9,31.24 78.87,17.27 78.87,10.54 78.99,10.29
  Bottom 0.61: IC1.20 25.78,48.39 24.51,48.39 C14.1 23.75,49.15 14.35,49.15 4.7,58.8 PWR.A | 25.78,30.61 24.51,30.61 C1.1 23.75,30.35 17.91,24.51 17.02,24.51 16.64,24.13 16.64,22.99 17.53,22.99 IC2.20 17.53,21.34 16.51,21.34 16.26,21.08 C2.1 15.49,20.95 C7.1 | 25.78,30.61 IC5.20 | C3.1 118.62,45.47 118.62,46.61 IC3.14 118.62,47.12 118.87,47.12 v119.25,47.5 | v119.25,54.1 118.75,54.1 118.62,54.23 IC3.8 | R1.2 113.79,33.27 110.36,33.27 JP3.2 | 101.85,4.95 101.47,4.95 IC4.1 | 101.85,4.95 102.11,5.21 102.11,6.48 101.47,6.48 IC4.3 | 101.85,4.95 101.98,4.7 101.98,3.94 107.7,3.94 +5V_IN.1 | v77.22,8.51 77.22,7.49 J1.31 | v64.9,31.24 26.54,31.24 26.04,30.73 25.78,30.61

### Text on the board
tPlace: Pugputer 6309 - SD POWER v2 | 12VDC 2A | CENTER +
tNames: AVRISP | GND | PD2 | PD3 | TXD | SDA | RXD | SCL | ADC7 | SCK | ADC6 | /RST | MISO | +5V | MOSI